# Altium schematic sheet CAN_Bus_v2.SchDoc
size B; SheetNumber: 1; SheetTotal: 1
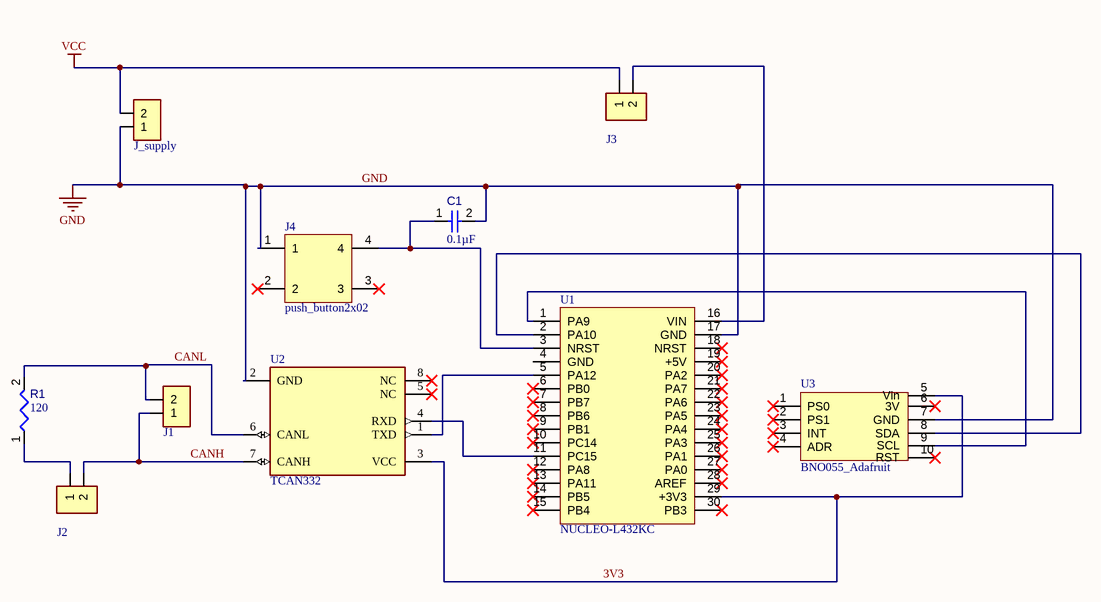
[diagram p0: CAN_Bus_v2.SchDoc]

## Parts
C1  value 0.1µF  [KEMT-C315-THT-2]  (hidden comment: ceramic_capacitor_throughhole)
J1  Goldpin_1x02  [HDRV2W63P254_1x02]  (value not drawn)
J2  Goldpin_1x02  [HDRV2W63P254_1x02]  (value not drawn)
J3  Goldpin_1x02  [HDRV2W63P254_1x02]  (value not drawn)
J4  push_button2x02  [push_button2x02]
J_supply  Goldpin_1x02  [HDRV2W63P254_1x02]  (value not drawn)
R1  value 120  [RESA60-630X240]  (hidden comment: MFR-25FBF52-2K21)
U1  NUCLEO-L432KC  [NUCLEO-L432KC]
U2  TCAN332  [FP-DCN0008A-IPC_A]
U3  BNO055_Adafruit  [BNO055_Adafruit]

## Nets
GND: C1.2 J4.1 J_supply.1 U1.17(GND) U2.2(GND) U3.7(GND)
VCC: J3.1 J_supply.2
3V3: U1.29(+3V3) U2.3(VCC) U3.5(Vin)
CANH: J1.1 J2.2 U2.7(CANH)
CANL: J1.2 R1.2 U2.6(CANL)
NetC1_1: C1.1 J4.4 U1.3(NRST)
NetJ2_1: J2.1 R1.1
NetJ3_2: J3.2 U1.16(VIN)
NetU1_1: U1.1(PA9) U3.9(SCL)
NetU1_2: U1.2(PA10) U3.8(SDA)
NetU1_5: U1.5(PA12) U2.1(TXD)
NetU1_11: U1.11(PC15) U2.4(RXD)

Not connected (* = marked no-connect by the designer): J4 2* 3*; U1 4(GND) 6(PB0)* 7(PB7)* 8(PB6)* 9(PB1)* 10(PC14)* 12(PA8)* 13(PA11)* 14(PB5)* 15(PB4)* 18(NRST)* 19(+5V)* 20(PA2)* 21(PA7)* 22(PA6)* 23(PA5)* 24(PA4)* 25(PA3)* 26(PA1)* 27(PA0)* 28(AREF)* 30(PB3)*; U2 5(NC)* 8(NC)*; U3 1(PS0)* 2(PS1)* 3(INT)* 4(ADR)* 6(3V)* 10(RST)*

## Notes on the sheet
- DWG. NO.
- REV.
- SHT.
- THIS DOCUMENT AND THE DATA DISCLOSED HEREIN OR HEREWITH IS THE PROPERTY OF ALTIUM LIMITED AND MAY BE FREELY DISTRIBUTED IN WHOLE. NO RIGHTS ARE RESERVED OR EXPRESS OR IMPLIED WARANTEE GIVEN.
- REVISION
- DESCRIPTION
- DATE
- APPROVED
- ENG:
- APPROVALS
- PROJECT
- DSN:
- CHK:
- REFERENCE DOCUMENTS
- PROJECT REVISION:
- TITLE
- DOCUMENT REVISION:
- DESIGN ITEM:
- BOM:
- FAB DWG:
- PCB DWG:
- ASSY DWG:
- SCALE:
- SIZE
- B
- CAGE CODE
- FILE NAME
- DWG NO.
- SHEET
- OF
- REV

## Library data of the parts
C1 = CMP-001-00084-1: Ceramic Capacitor, Multilayer, Ceramic, 200V, 5% +Tol, 5% -Tol, C0G, 30ppm/Cel TC, 0.00001uF, Through Hole Mount; Multilayer: Yes; Terminal Pitch: 2.54mm; Max Operating Temperature: 125°C; Min Operating Temperature: -55°C; Termination: Wire; Package Style: RadialMeter; Tolerance (fill in as +-): 5%; Length: 3.81mm; Capacitor Type: Ceramic; Reach SVHC Compliant: Yes; Packaging: Bulk; Tolerance  (fill in as +-): 5%; JESD-609 Code: e3; Terminal Finish: Nickel; Temperature Characteristics Code: C0G; Pins: 2; Width: 2.54mm; Mounting Technology: Through Hole; Case/Package: 1510; Dielectric Material: Ceramic; RoHS Compliant: Yes; Rated DC Voltage (URdc): 200V; Height: 5.33mm; Package Shape: Rectangular
R1 = CMP-009-00054-4: Axial Resistor, 2.21 KOhm, +/- 1%, 0.25 W, -55 to 155 degC, 2-Pin THD, RoHS, Bulk; Manufacturer: Yageo; Voltage Rating: 250V; Power: 250mW; Tolerance: 1%; Package Reference: MFR-25; Packaging: Bulk; Datasheet Version: Apr-13; Manufacturer URL: http://www.yageo.com/; Package Description: 2-Pin Axial Lead, Dia 2.4 mm, Body Length 6.3 mm; Mounting Technology: TH; RoHS Compliant: True; Package Quantity: 200; Min Operating Temperature: -55°C; Case/Package: Axial; Max Operating Temperature: 155°C; Datasheet URL: http://www.yageo.com/documents/recent/Yageo%20LR_MFR_2013.pdf
U1 = NUCLEO-L432KC: Arm® Cortex®-M4 32-bit MCU, 24 MHz, 256 KB Flash; HelpURL: https://www.st.com/en/evaluation-tools/nucleo-l432kc.html; PN: NUCLEO-L432KC
U2 = CMP-015-00008-1: Interface Circuit, PDSO8, CAN Transceiver; Channels: 1; Nominal Supply Voltage: 3.3V; Package Body Material: Plastic; Package Shape: Rectangular; JESD-30 Code: R-PDSO-G8; Pins: 8; Telecom IC Type: INTERFACE CIRCUIT; Terminal Pitch: 0.65mm; Surface Mount: Yes; Width: 1.6mm; Moisture Sensitivity Level: 1; JESD-609 Code: e4; RoHS Compliant: Yes; Terminal Finish: Nickel; Height - Seated (Max): 1.45mm; Min Operating Temperature: -40°C; Case/Package: LSSOP; Temperature Grade: AUTOMOTIVE; Reach SVHC Compliant: Yes; Terminal Form: Gull Wing; Max Operating Temperature: 125°C; Length: 2.9mm; Terminal Position: DUAL; Package Style: SMALL OUTLINE, LOW PROFILE, SHRINK PITCHMeter
U3 = BNO055_Adafruit: Adafruit BNO055 9-dof IMU sensor